# EAGLE design Papilio-Audio_Wing-v10 (EAGLE 6.2)
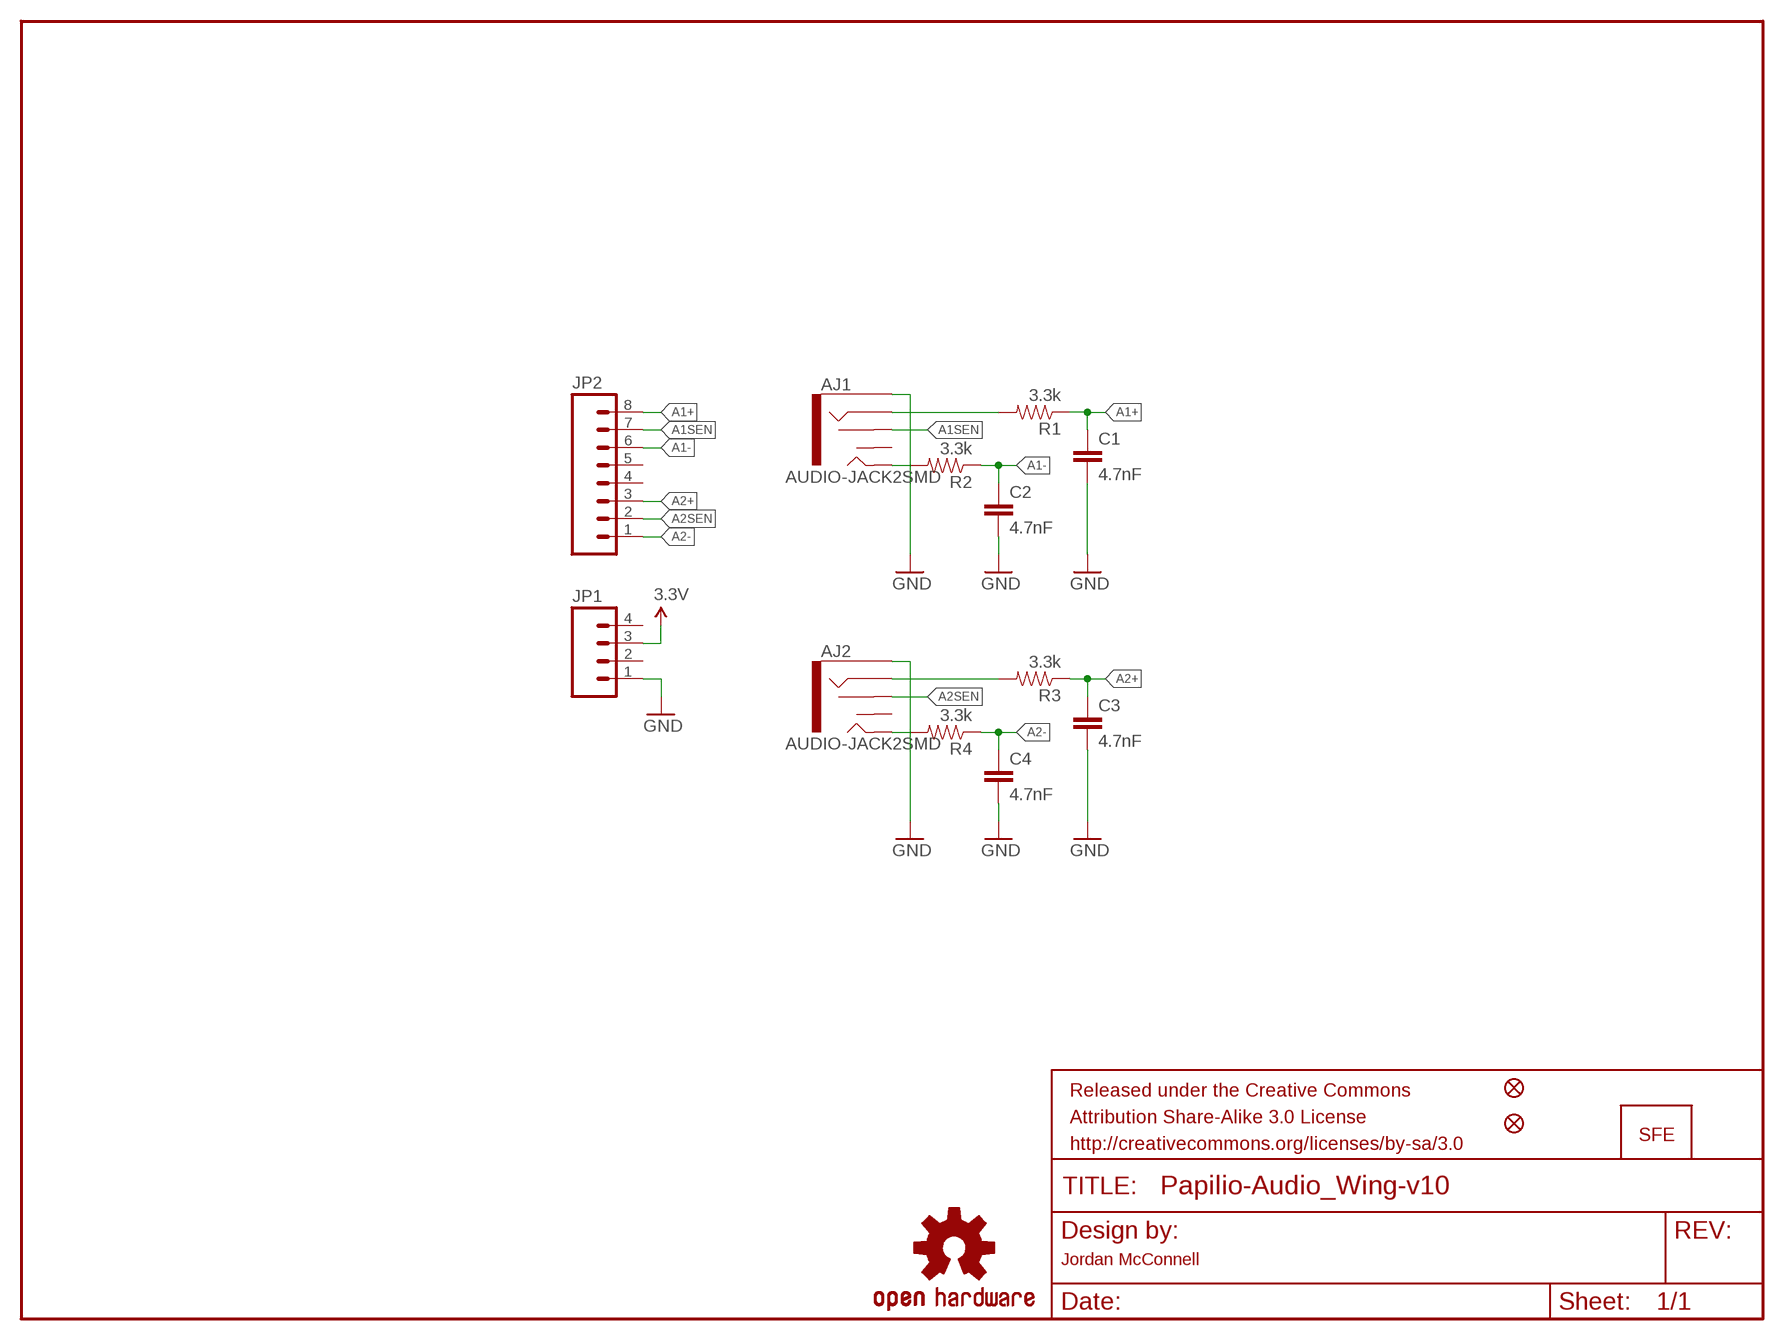
[diagram p0: schematic, sheet 1]

## Parts
AJ1  AUDIO-JACK2SMD  [AUDIO-JACK-3.5MM-SMD]
AJ2  AUDIO-JACK2SMD  [AUDIO-JACK-3.5MM-SMD]
C1  4.7nF  CAP0402-CAP  [0402-CAP]
C2  4.7nF  CAP0402-CAP  [0402-CAP]
C3  4.7nF  CAP0402-CAP  [0402-CAP]
C4  4.7nF  CAP0402-CAP  [0402-CAP]
FRAME2  FRAME-LETTER  [CREATIVE_COMMONS]
JP1  M04PTH  [1X04]
JP2  M081X08  [1X08]
JP4  LOGO-SFENEW  [SFE-NEW-WEBLOGO]
JP5  FIDUCIALUFIDUCIAL  [MICRO-FIDUCIAL]
JP6  FIDUCIALUFIDUCIAL  [MICRO-FIDUCIAL]
R1  3.3k  RESISTOR0402-RES  [0402-RES]
R2  3.3k  RESISTOR0402-RES  [0402-RES]
R3  3.3k  RESISTOR0402-RES  [0402-RES]
R4  3.3k  RESISTOR0402-RES  [0402-RES]
U$1  OSHW-LOGOS  [OSHW-LOGO-S]

## Nets
3.3V: JP1.3
A1+: C1.1 JP2.8 R1.1
A1-: C2.1 JP2.6 R2.1
A1SEN: AJ1.RSH JP2.7
A2+: C3.1 JP2.3 R3.1
A2-: C4.1 JP2.1 R4.1
A2SEN: AJ2.RSH JP2.2
GND: AJ1.SLEEVE AJ2.SLEEVE C1.2 C2.2 C3.2 C4.2 JP1.1
N$1: AJ2.RING R3.2
N$2: AJ2.TIP R4.2
N$3: AJ1.RING R1.2
N$4: AJ1.TIP R2.2
Unconnected: AJ1.TSH AJ2.TSH JP1.2 JP1.4 JP2.4 JP2.5

## Notes on the sheet
- Jordan McConnell

## Library data of the parts
AJ1 AJ2 = SparkFun-Connectors:AUDIO-JACK2: Stereo audio jack with bypass switches.
C1-C4 = SparkFun-Passives:CAP: Capacitor Standard 0603 ceramic capacitor, and 0.1" leaded capacitor.
FRAME2 = SparkFun-Aesthetics:FRAME-LETTER: Schematic Frame Standard 8.5x11 US Letter frame
JP1 = SparkFun-Connectors:M04: Header 4 Standard 4-pin 0.1" header. Use with straight break away headers (SKU : PRT-00116), right angle break away headers (PRT-00553), swiss pins (PRT-00743), machine pins (PRT-00117), and female headers (PRT-00115). Molex polarized connector foot print use with SKU : PRT-08231 with associated crimp pins and housings. 1MM SMD Version SKU: PRT-10208
JP2 = SparkFun-Connectors:M08: Header 8 Standard 8-pin 0.1" header. Use with straight break away headers (SKU : PRT-00116), right angle break away headers (PRT-00553), swiss pins (PRT-00743), machine pins (PRT-00117), and female headers (PRT-00115).
JP4 = SparkFun-Aesthetics:LOGO-SFE: Spark Fun Electronics PCB Logo This is the standard Spark Fun Electronics PCB logo.
JP5 JP6 = SparkFun:FIDUCIAL: Fiducial Alignment Points Various fiducial points for machine vision alignment.
R1-R4 = SparkFun-Passives:RESISTOR: Resistor Basic schematic elements and footprints for 0603, 1206, and PTH resistors.
U$1 = SparkFun-Aesthetics:OSHW-LOGO: Open Source Hardware Logo This logo indicates the piece of hardware it is found on incorporates a OSHW license and/or adheres to the definition of open source hardware found here: http://freedomdefined.org/OSHW

## Board
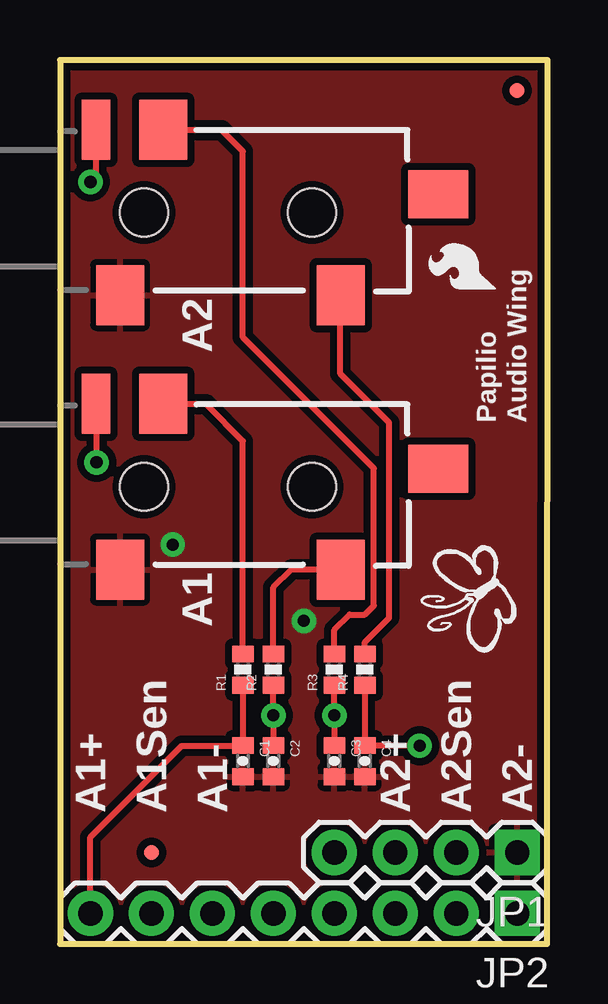
[diagram p1: board, top side]
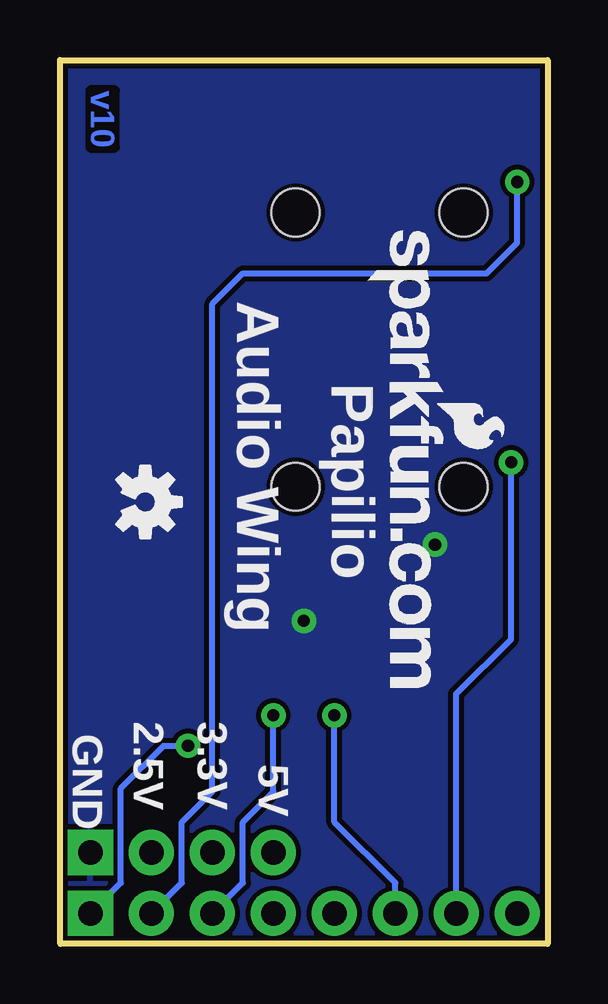
[diagram p2: board, bottom side, seen from below]

Size 20.32 x 36.83 mm. Coordinates in mm from the lower left corner, seen from the top.
Outline: 0,0 20.3,0 20.32,36.83 0,36.83 0,0
Copper layers (1*16): Top 0.035mm / dielectric 1.5mm / Bottom 0.035mm
Design rules: minimum track width 8mil, minimum drill 20mil, track to track 8mil, track to pad 8mil, pad to pad 8mil, via to via 8mil, smd to smd 8mil, copper to edge 8mil, drill to drill 8mil, minimum pad ring 12mil, minimum via ring 10mil, stop-mask expansion 4mil, vias tented up to drill 20mil, thermal gap 10mil

### Footprints (pad centres in the part's own frame; a part is rotated, then mirrored left to right if it is on the bottom)
AUDIO-JACK-3.5MM-SMD = smd 2 x 2.5: RING 4.3,3.45; SLEEVE 2.5,-3.45; TIP 11.7,-3.45 | smd 1.2 x 2.5: RSH 1.5,3.45 | smd 2.5 x 2: TSH 15.75,0.75 | hole 2: 3.5,0; 10.5,0
0402-CAP = smd 0.7 x 0.9: 1 -0.65,0; 2 0.65,0
1X04 = drill 1.016 pad 1.88 square: 1 0,0 | drill 1.016 pad 1.88: 2 2.54,0; 3 5.08,0; 4 7.62,0
1X08 = drill 1.016 pad 1.88 square: 1 0,0 | drill 1.016 pad 1.88: 2 2.54,0; 3 5.08,0; 4 7.62,0; 5 10.16,0; 6 12.7,0; 7 15.24,0; 8 17.78,0
MICRO-FIDUCIAL = smd 0.635 x 0.635: 1 0,0
0402-RES = smd 0.7 x 0.9: 1 -0.65,0; 2 0.65,0

### Placement (x,y rotation side)
AJ1  0,19.05 0 top
AJ2  0,30.48 0 top
C1  7.62,7.62 270 top
C2  8.89,7.62 270 top
C3  11.43,7.62 270 top
C4  12.7,7.62 270 top
FRAME1  FRAME-LETTER  [CREATIVE_COMMONS]  -3.81,-11.43 0 top  (outside the outline)
FRAME2  -3.81,-21.59 0 top  (outside the outline)
JP1  19.05,3.81 180 top
JP2  19.05,1.27 180 top
JP3  LOGO-SFESK  [SFE-LOGO-FLAME]  18.16,27.3 90 top
JP4  7.49,29.72 270 bottom
JP5  3.81,3.81 0 top
JP6  19.05,35.56 0 top
R1  7.62,11.43 90 top
R2  8.89,11.43 90 top
R3  11.43,11.43 90 top
R4  12.7,11.43 90 top
U$1  16.76,18.41 270 bottom

### Tracks (layer width: path | path; a pad name or v marks a point on that pad's centre or on a via)
A1+
  Top 0.254: JP2.8 1.27,4.45 5.08,8.26 7.61,8.26 C1.1 R1.1
A1-  (via drill 0.51)
  Top 0.254: R2.1 v8.89,9.53 C2.1
  Bottom 0.254: JP2.6 6.35,2.54 8.89,5.08 v8.89,9.53
A1SEN  (via drill 0.51)
  Top 0.254: v1.52,20.07 1.52,22.48 AJ1.RSH
  Bottom 0.254: JP2.7 3.81,10.41 1.52,12.7 v1.52,20.07
A2+  (via drill 0.51)
  Top 0.254: R3.1 v11.43,9.53 C3.1
  Bottom 0.254: JP2.3 12.7,2.54 12.7,5.08 11.43,6.35 v11.43,9.53
A2-  (via drill 0.51)
  Top 0.254: R4.1 C4.1 12.71,8.26 v14.99,8.26
  Bottom 0.254: JP2.1 17.78,2.54 17.78,6.48 16,8.26 v14.99,8.26
A2SEN  (via drill 0.51)
  Top 0.254: v1.27,31.75 1.5,31.98 AJ2.RSH
  Bottom 0.254: v1.27,31.75 1.27,29.21 2.54,27.94 12.7,27.94 13.97,26.67 13.97,6.35 15.24,5.08 15.24,2.54 JP2.2
GND  (via drill 0.51)
  other vias: 4.7,16.64 10.16,13.46
  pour Top (isolate 0.305): 0,0 0,36.83 20.32,36.83 20.32,0
  pour Bottom: 0,0 0,36.83 20.32,36.83 20.32,0
N$1
  Top 0.254: R3.2 11.43,13.08 12.06,13.72 12.7,13.72 13.08,14.1 13.08,19.81 7.62,25.27 7.62,33.02 6.73,33.91 4.32,33.91 AJ2.RING
N$2
  Top 0.254: AJ2.TIP 11.68,27.01 11.68,23.75 13.72,21.72 13.72,13.59 12.7,12.57 R4.2
N$3
  Top 0.254: R1.2 7.62,20.95 6.1,22.48 4.32,22.48 AJ1.RING
N$4
  Top 0.254: R2.2 8.89,14.86 9.65,15.62 11.68,15.62 AJ1.TIP

### Text on the board
Bottom: v10
tPlace: A2 | Papilio | Audio Wing | A1 | A1+ | A1Sen | A1- | A2+ | A2Sen | A2-
bPlace: Audio Wing | Papilio | 3.3V | 2.5V | GND | 5V
tValues: Jordan McConnell